# Altium schematic sheet RTU_LMG_gps_acond.SchDoc
size A3; SheetNumber: 8; SheetTotal: 17
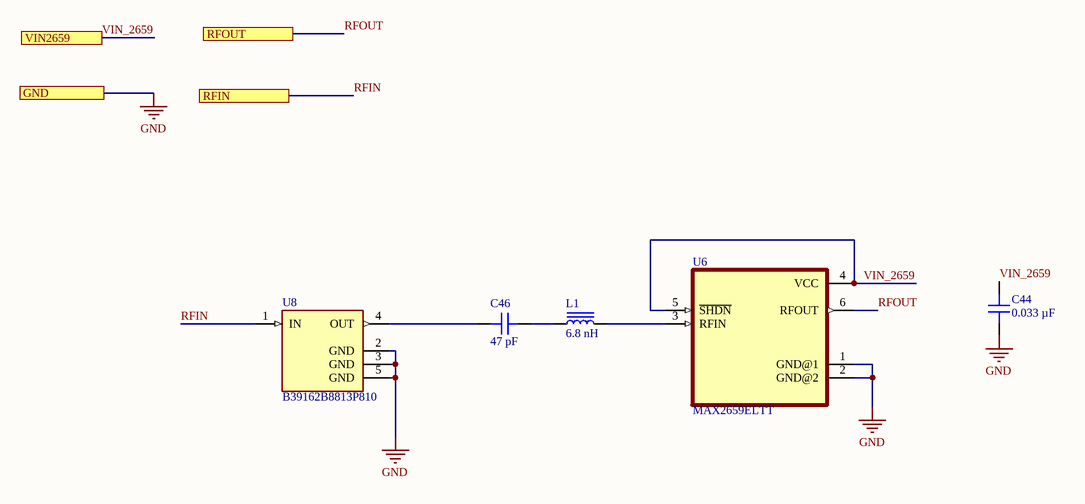
[diagram p0: RTU_LMG_gps_acond.SchDoc]

## Parts
C44  0.033 µF  [CAP 0603_1608]
C46  47 pF  [CAP 0603_1608]
L1  6.8 nH  [INDC1005X55N]
U6  MAX2659ELTT  [SON50P150X100X80-6N]
U8  B39162B8813P810  [FIL_B39162B9417K610]

## Ports
GND, RFIN, RFOUT, VIN2659

## Nets
GND: C44.1 U6.1(GND@1) U6.2(GND@2) U8.2(GND) U8.3(GND) U8.5(GND) ; port GND
RFIN: U8.1(IN) ; port RFIN
RFOUT: U6.6(RFOUT) ; port RFOUT
VIN_2659: C44.2 U6.4(VCC) U6.5(~{SHDN}) ; port VIN2659
NetC46_1: C46.1 U8.4(OUT)
NetC46_2: C46.2 L1.1
NetL1_2: L1.2 U6.3(RFIN)

## Library data of the parts
C44 = C0603C333J4REC7411: CAP CER 0603 33NF 16V X7R 5%; manufacturer: KEMET; Part Number: C0603C333J4REC7411; Capacitance: 0.033 µF; Applications: ESD Protection; componentlink1description: Datasheet; componentlink1url: https://api.kemet.com/component-edge/download/datasheet/C0603C333J4REC7411.pdf; componentlink2description: DigiKey Link; componentlink2url: https://www.digikey.com/en/products/detail/kemet/C0603C333J4REC7411/8645086; Device Package: 0603 (1608 Metric); lastupdated: 9/2/2024 20:09:55; Lifecycle Status: Active; Minimum Order: 1; Mounting Type: Surface Mount, MLCC; Operating Temperature: -55°C ~ 125°C; Package / Case: 0603 (1608 Metric); packaging: TapeAndReel; partid: 34885; Part Status: Active; price: 0.01; series: ESD SMD Comm X7R; Size / Dimension: 0.063" L x 0.031" W (1.60mm x 0.80mm); Supplier 1: DigiKey; Supplier Part Number 1: 399-C0603C333J4REC7411CT-ND; Temperature Coefficient: X7R; Thickness (Max): 0.034" (0.87mm); Tolerance: ±5%; value: 0.033 µF; Voltage - Rated: 16V
C46 = 885012006021: CAP CER 47PF 16V C0G/NP0 0603; manufacturer: Würth Elektronik; Temperature Coefficient: C0G, NP0; Tolerance: ±5%; Part Number: 885012006021; Capacitance: 47 pF; Applications: General Purpose; componentlink1description: Datasheet; componentlink1url: https://katalog.we-online.de/pbs/datasheet/885012006021.pdf; componentlink2description: DigiKey Link; componentlink2url: https://www.digikey.com/en/products/detail/würth-elektronik/885012006021/5453619; Device Package: 0603 (1608 Metric); lastupdated: 9/2/2024 20:10:29; Lifecycle Status: Active; Minimum Order: 1; Mounting Type: Surface Mount, MLCC; Operating Temperature: -55°C ~ 125°C; Package / Case: 0603 (1608 Metric); packaging: TapeAndReel; partid: 2856; Part Status: Active; price: 0.02; series: WCAP-CSGP; Size / Dimension: 0.063" L x 0.031" W (1.60mm x 0.80mm); Supplier 1: DigiKey; Supplier Part Number 1: 732-7764-1-ND; Thickness (Max): 0.034" (0.87mm); value: 47 pF; Voltage - Rated: 16V
L1 = LQG15HH6N8J02D: FIXED IND 6.8NH 600MA 0.24OHM SM; Manufacturer: Murata Electronics; DC Resistance (DCR): 240mOhm Max; Frequency - Self Resonant: 4.5GHz; Inductance Frequency - Test: 100 MHz; Material - Core: Air; Q @ Freq: 8 @ 100MHz; Shielding: Unshielded; Tolerance: ±5%; Type: Multilayer; Part Number: LQG15HH6N8J02D; ComponentLink1Description: Datasheet; ComponentLink1URL: https://search.murata.co.jp/Ceramy/image/img/P02/JELF243B-9101.pdf; ComponentLink2Description: DigiKey Link; ComponentLink2URL: https://www.digikey.com/en/products/detail/murata-electronics/LQG15HH6N8J02D/2594193; Current Rating (Amps): 600 mA; Device Package: 0402 (1005 Metric); Height - Seated (Max): 0.022" (0.55mm); Inductance: 6.8 nH; LastUpdated: 3/6/2024 20:13:14; Lifecycle Status: Active; Minimum Order: 1; Mounting Type: Surface Mount; Operating Temperature: -55°C ~ 125°C; Package / Case: 0402 (1005 Metric); Packaging: TapeAndReel; PartId: 1331; Part Status: Active; Price: 0.05; Ratings: AEC-Q200; Series: LQG15; Size / Dimension: 0.039" L x 0.020" W (1.00mm x 0.50mm); Supplier 1: DigiKey; Supplier Part Number 1: 490-11669-1-ND; Supplier Device Package: 0402 (1005 Metric); Value: 6.8 nH
U6 = MAX2659ELTT: GPS/GNSS Low-Noise Amplifier; MF: Analog Devices; MP: MAX2659ELT+T; SnapEDA_Link: https://www.snapeda.com/parts/MAX2659ELT+T/Analog+Devices/view-part/?ref=snap; Package: MICRO DFN-6 Maxim; Value: *; Check_prices: https://www.snapeda.com/parts/MAX2659ELT+T/Analog+Devices/view-part/?ref=eda
U8 = B39162B8813P810: SAW Filter RF 1582.47MHz 1.9dB 50Ohm SMD 5 Pin SMT; MF: RF 360; Value: *; SnapEDA_Link: https://www.snapeda.com/parts/B39162B8813P810/RF+Digital/view-part/?ref=snap; Purchase-URL: https://pricing.snapeda.com/search/part/B39162B8813P810/?ref=eda; Availability: In Stock; Price: None; Package: SMD-5 RF 360; Check_prices: https://www.snapeda.com/parts/B39162B8813P810/RF+Digital/view-part/?ref=eda; MP: B39162B8813P810